# Altium schematic sheet indication.SchDoc
size A4
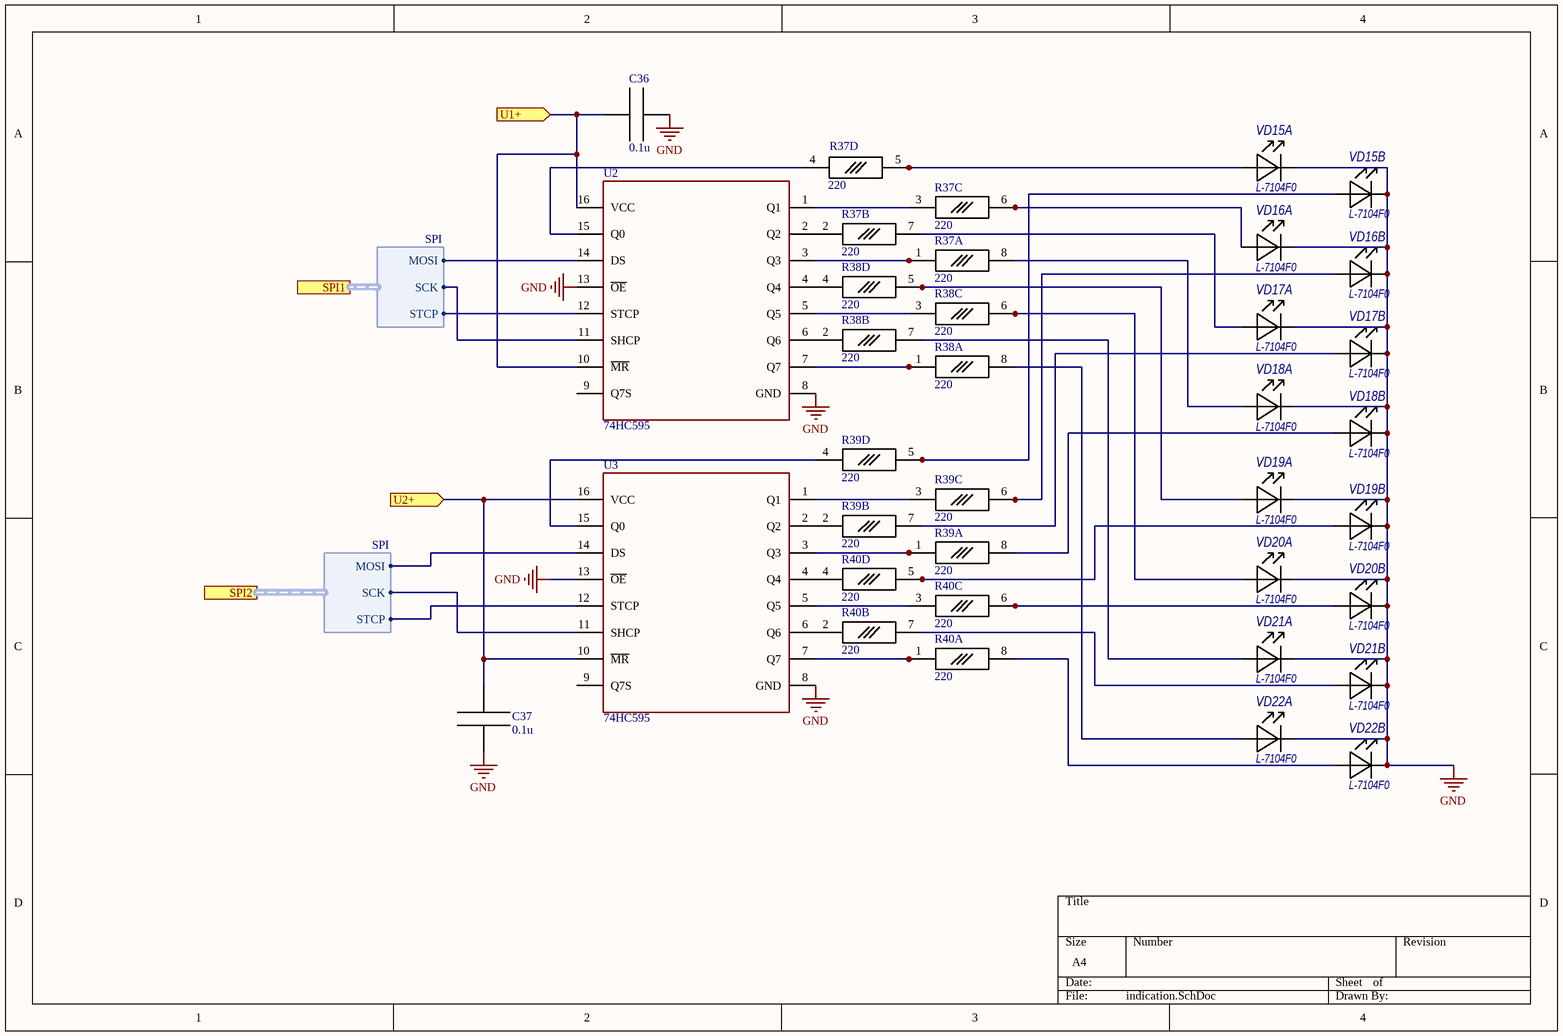
[diagram p0: indication.SchDoc]

## Parts
C36  0.1u  [cap_0402]
C37  0.1u  [cap_0402]
R37  220  [YC164]  (parts A,B,C,D of 4)
R38  220  [YC164]  (parts A,B,C,D of 4)
R39  220  [YC164]  (parts A,B,C,D of 4)
R40  220  [YC164]  (parts A,B,C,D of 4)
U2  74HC595  [TSSOP16]
U3  74HC595  [TSSOP16]
VD15  Type: L-7104F0  [L-7104_]  (hidden comment: Diod_sv_L-7104F0)  (parts A,B of 2)
VD16  Type: L-7104F0  [L-7104_]  (hidden comment: Diod_sv_L-7104F0)  (parts A,B of 2)
VD17  Type: L-7104F0  [L-7104_]  (hidden comment: Diod_sv_L-7104F0)  (parts A,B of 2)
VD18  Type: L-7104F0  [L-7104_]  (hidden comment: Diod_sv_L-7104F0)  (parts A,B of 2)
VD19  Type: L-7104F0  [L-7104_]  (hidden comment: Diod_sv_L-7104F0)  (parts A,B of 2)
VD20  Type: L-7104F0  [L-7104_]  (hidden comment: Diod_sv_L-7104F0)  (parts A,B of 2)
VD21  Type: L-7104F0  [L-7104_]  (hidden comment: Diod_sv_L-7104F0)  (parts A,B of 2)
VD22  Type: L-7104F0  [L-7104_]  (hidden comment: Diod_sv_L-7104F0)  (parts A,B of 2)

## Ports
SPI1 (harness SPI), SPI2 (harness SPI), U1+ (in), U2+ (in)

## Harnesses
SPI: MOSI, SCK, STCP

## Nets
GND: C36.2 C37.2 U2.8(GND) U2.13(~{OE}) U3.8(GND) U3.13(~{OE}) VD15.2(K1) VD15.4(K2) VD16.2(K1) VD16.4(K2) VD17.2(K1) VD17.4(K2) VD18.2(K1) VD18.4(K2) VD19.2(K1) VD19.4(K2) VD20.2(K1) VD20.4(K2) VD21.2(K1) VD21.4(K2) VD22.2(K1) VD22.4(K2)
U1+: C36.1 U2.10(~{MR}) U2.16(VCC) ; port U1+
U2+: C37.1 U3.10(~{MR}) U3.16(VCC) ; port U2+
NetR37_1: R37.1 U2.3(Q3)
NetR37_2: R37.2 U2.2(Q2)
NetR37_3: R37.3 U2.1(Q1)
NetR37_4: R37.4 U2.15(Q0)
NetR37_5: R37.5 VD15.1(A1)
NetR37_6: R37.6 VD16.1(A1)
NetR37_7: R37.7 VD17.1(A1)
NetR37_8: R37.8 VD18.1(A1)
NetR38_1: R38.1 U2.7(Q7)
NetR38_2: R38.2 U2.6(Q6)
NetR38_3: R38.3 U2.5(Q5)
NetR38_4: R38.4 U2.4(Q4)
NetR38_5: R38.5 VD19.1(A1)
NetR38_6: R38.6 VD20.1(A1)
NetR38_7: R38.7 VD21.1(A1)
NetR38_8: R38.8 VD22.1(A1)
NetR39_1: R39.1 U3.3(Q3)
NetR39_2: R39.2 U3.2(Q2)
NetR39_3: R39.3 U3.1(Q1)
NetR39_4: R39.4 U3.15(Q0)
NetR39_5: R39.5 VD15.3(A2)
NetR39_6: R39.6 VD16.3(A2)
NetR39_7: R39.7 VD17.3(A2)
NetR39_8: R39.8 VD18.3(A2)
NetR40_1: R40.1 U3.7(Q7)
NetR40_2: R40.2 U3.6(Q6)
NetR40_3: R40.3 U3.5(Q5)
NetR40_4: R40.4 U3.4(Q4)
NetR40_5: R40.5 VD19.3(A2)
NetR40_6: R40.6 VD20.3(A2)
NetR40_7: R40.7 VD21.3(A2)
NetR40_8: R40.8 VD22.3(A2)
NetU2_11: U2.11(SHCP) ; port SPI1.SCK
NetU2_12: U2.12(STCP) ; port SPI1.STCP
NetU2_14: U2.14(DS) ; port SPI1.MOSI
NetU3_11: U3.11(SHCP) ; port SPI2.SCK
NetU3_12: U3.12(STCP) ; port SPI2.STCP
NetU3_14: U3.14(DS) ; port SPI2.MOSI

Not connected (* = marked no-connect by the designer): U2 9(Q7S); U3 9(Q7S)

## Library data of the parts
C36 C37 = cap
R37-R40 = res_array: YC164